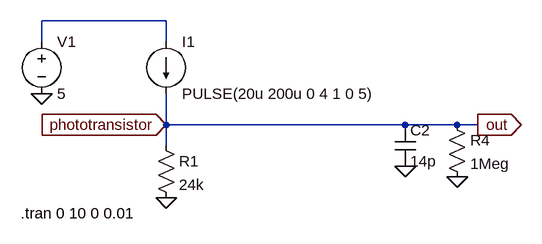
[diagram p0: schematic LightDetector.asc]
LightDetector.asc, the LTspice schematic file:
Version 4
SHEET 1 880 680
WIRE 224 48 32 48
WIRE 32 80 32 48
WIRE 224 80 224 48
WIRE 224 208 224 160
WIRE 592 208 224 208
WIRE 672 208 592 208
WIRE 704 208 672 208
WIRE 224 240 224 208
FLAG 32 160 0
FLAG 224 320 0
FLAG 224 208 phototransistor
IOPIN 224 208 In
FLAG 592 272 0
FLAG 704 208 out
IOPIN 704 208 Out
FLAG 672 288 0
SYMBOL voltage 32 64 R0
WINDOW 123 0 0 Left 0
WINDOW 39 0 0 Left 0
SYMATTR InstName V1
SYMATTR Value 5
SYMBOL current 224 80 R0
WINDOW 123 0 0 Left 0
WINDOW 39 0 0 Left 0
SYMATTR InstName I1
SYMATTR Value PULSE(20u 200u 0 4 1 0 5)
SYMBOL res 208 224 R0
SYMATTR InstName R1
SYMATTR Value 24k
SYMBOL res 656 192 R0
SYMATTR InstName R4
SYMATTR Value 1Meg
SYMBOL cap 576 208 R0
SYMATTR InstName C2
SYMATTR Value 14p
TEXT 0 344 Left 2 !.tran 0 10 0 0.01

The netlist it stands for:
* LightDetector.asc
V1 N001 0 5
I1 N001 out PULSE(20u 200u 0 4 1 0 5)
R1 out 0 24k
R4 out 0 1Meg
C2 out 0 14p
.tran 0 10 0 0.01
.backanno
.end